# Altium project MK66ofThreeRounds_Project.PrjPcb
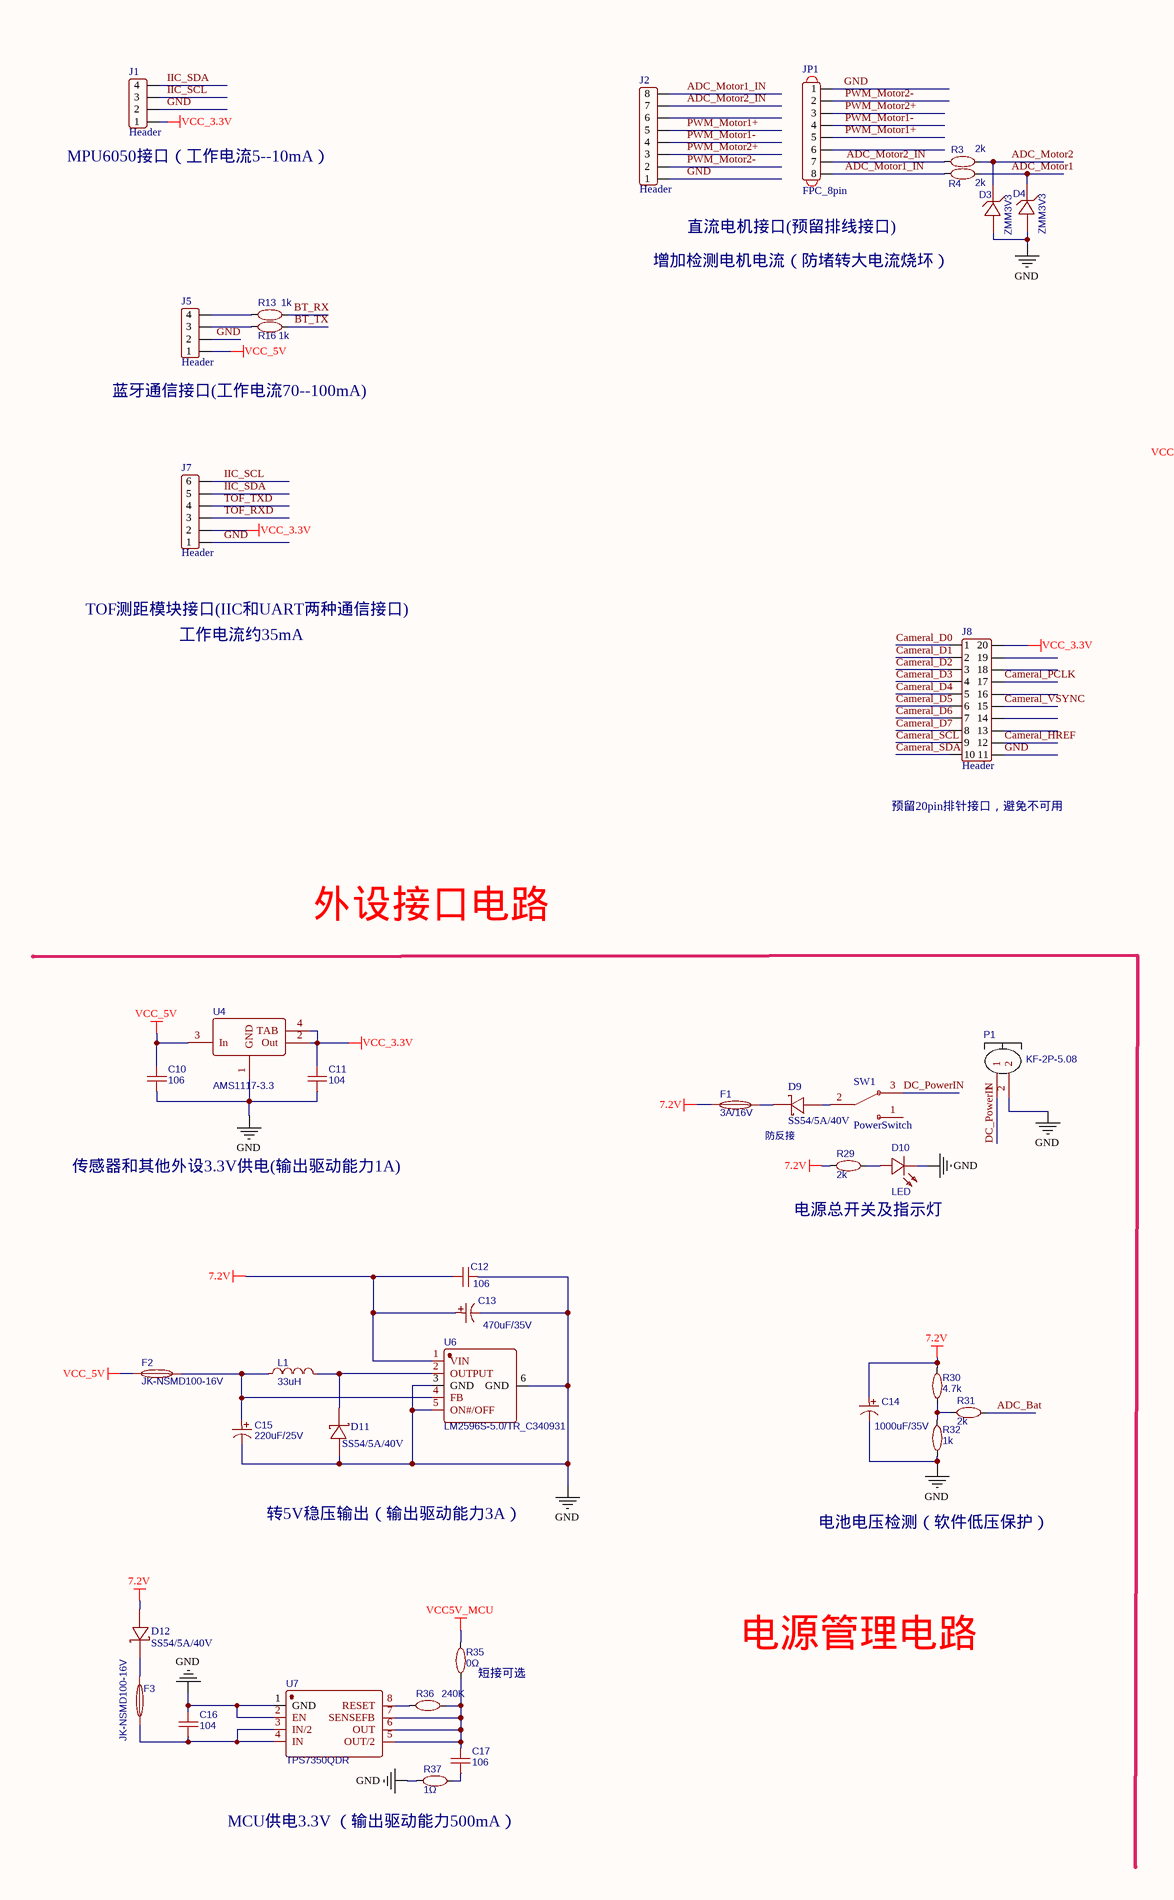
[diagram p0: MK66MCU.SchDoc, left]
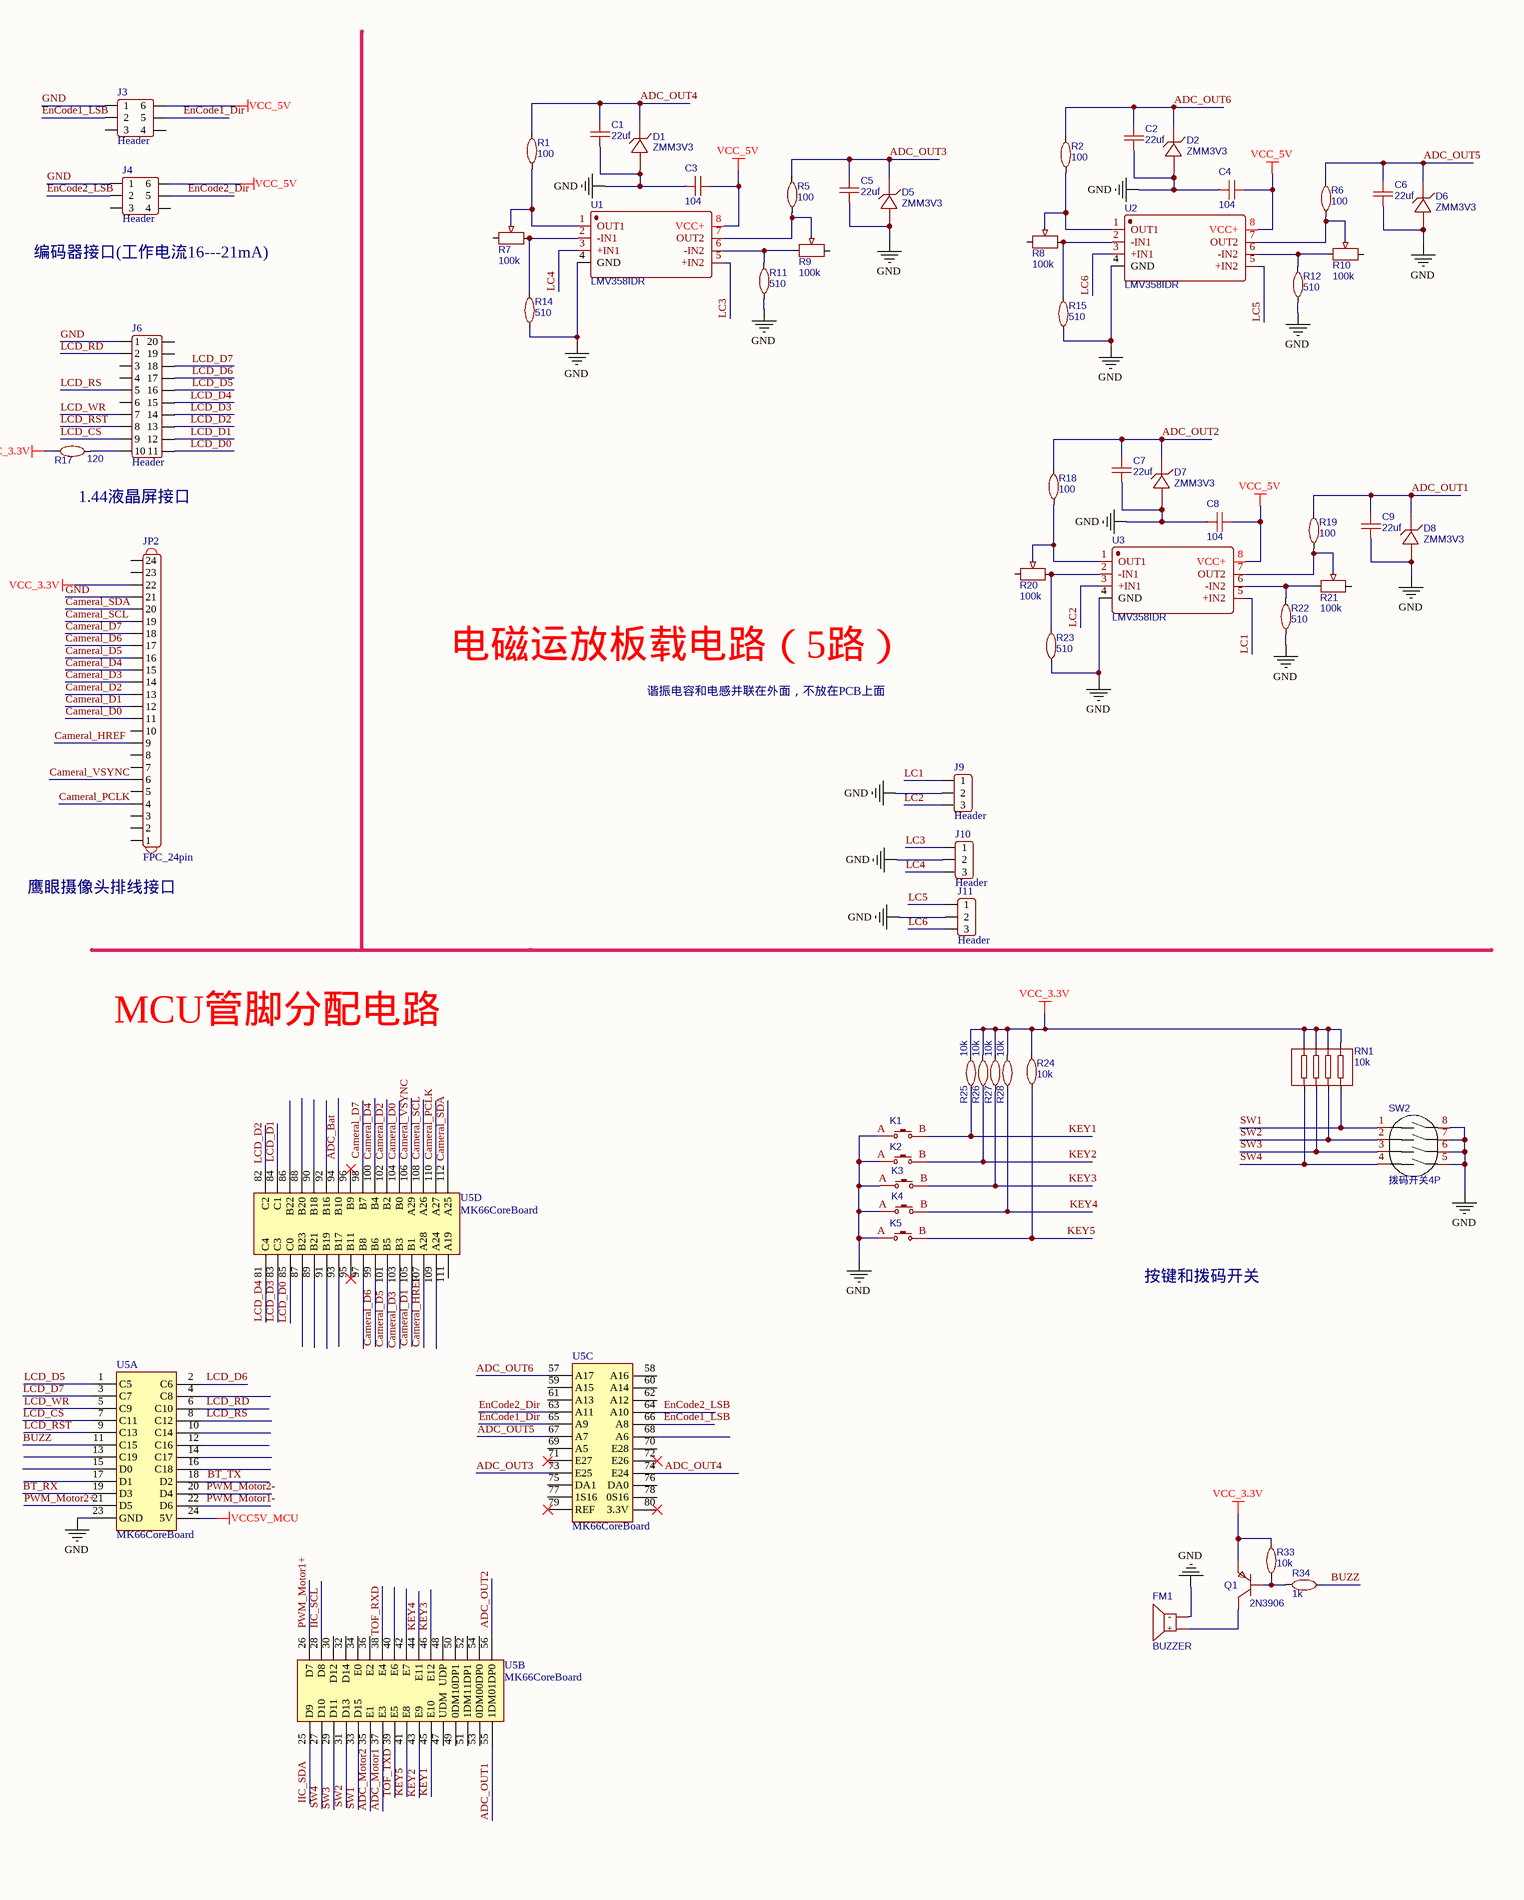
[diagram p1: MK66MCU.SchDoc, right]
1 sheet, 101 parts. Net scope: global (net labels, ports and power ports of the same name join across sheets).
Board file: MK66MUC.PcbDoc

## Sheet MK66MCU.SchDoc
size A2

### Parts
C1  22uf  [CAP_0603]
C2  22uf  [CAP_0603]
C3  104  [CAP_0603]
C4  104  [CAP_0603]
C5  22uf  [CAP_0603]
C6  22uf  [CAP_0603]
C7  22uf  [CAP_0603]
C8  104  [CAP_0603]
C9  22uf  [CAP_0603]
C10  106  [CAP_0603]
C11  104  [CAP_0603]
C12  106  [CAP_0603]
C13  470uF/35V  [CAPE_SMD_F_8.4]
C14  1000uF/35V  [CAPE_SMD_G_10.6]
C15  220uF/25V  [CAPE_SMD_D_6.4]
C16  104  [CAP_0603]
C17  106  [CAP_0603]
D1  ZMM3V3  [LL-34_L3.5-W1.5-RD]
D2  ZMM3V3  [LL-34_L3.5-W1.5-RD]
D3  ZMM3V3  [LL-34_L3.5-W1.5-RD]
D4  ZMM3V3  [LL-34_L3.5-W1.5-RD]
D5  ZMM3V3  [LL-34_L3.5-W1.5-RD]
D6  ZMM3V3  [LL-34_L3.5-W1.5-RD]
D7  ZMM3V3  [LL-34_L3.5-W1.5-RD]
D8  ZMM3V3  [LL-34_L3.5-W1.5-RD]
D9  SS54/5A/40V  [DO214_SMA]
D10  LED  [LED_0603_B]
D11  SS54/5A/40V  [DO214_SMA]
D12  SS54/5A/40V  [DO214_SMA]
F1  3A/16V  [F1206]
F2  JK-NSMD100-16V  [F1206]
F3  JK-NSMD100-16V  [F1206]
FM1  BUZZER  [BUZZ-12*7.5]
J1  Header  [Header 2.54X4]
J2  Header  [Header 2.54X8]
J3  Header  [Header 2.54_2X3]
J4  Header  [Header 2.54_2X3]
J5  Header  [Header F 2.54X4]
J6  Header  [Header F 2.54_2x10]
J7  Header  [Header 2.54X6]
J8  Header  [Header F 2.54_2x10]
J9  Header  [Header 2.54X3]
J10  Header  [Header 2.54X3]
J11  Header  [Header 2.54X3]
JP1  FPC_8pin  [FPC_1.0_8P]
JP2  FPC_24pin  [FPC_0.5_24P]
K1  TS-Button_2P  [SW_SMD_6.1*3.7]  (value not drawn)
K2  TS-Button_2P  [SW_SMD_6.1*3.7]  (value not drawn)
K3  TS-Button_2P  [SW_SMD_6.1*3.7]  (value not drawn)
K4  TS-Button_2P  [SW_SMD_6.1*3.7]  (value not drawn)
K5  TS-Button_2P  [SW_SMD_6.1*3.7]  (value not drawn)
L1  33uH  [IND-SMD_L8.0-W8.0]
P1  KF-2P-5.08  [KF_2P-5.08]
Q1  2N3906  [TO_92A]
R1  100  [RES_0603]
R2  100  [RES_0603]
R3  2k  [RES_0603]
R4  2k  [RES_0603]
R5  100  [RES_0603]
R6  100  [RES_0603]
R7  100k  [RES_POT-3296W]
R8  100k  [RES_POT-3296W]
R9  100k  [RES_POT-3296W]
R10  100k  [RES_POT-3296W]
R11  510  [RES_0603]
R12  510  [RES_0603]
R13  1k  [RES_0603]
R14  510  [RES_0603]
R15  510  [RES_0603]
R16  1k  [RES_0603]
R17  120  [RES_0603]
R18  100  [RES_0603]
R19  100  [RES_0603]
R20  100k  [RES_POT-3296W]
R21  100k  [RES_POT-3296W]
R22  510  [RES_0603]
R23  510  [RES_0603]
R24  10k  [RES_0603]
R25  10k  [RES_0603]
R26  10k  [RES_0603]
R27  10k  [RES_0603]
R28  10k  [RES_0603]
R29  2k  [RES_0603]
R30  4.7k  [RES_0603]
R31  2k  [RES_0603]
R32  1k  [RES_0603]
R33  10k  [RES_0603]
R34  1k  [RES_0603]
R35  0Ω  [RES_0603]
R36  240K  [RES_0603]
R37  1Ω  [RES_0603]
RN1  10k  [RES-ARRAY-SMD_0603-8P-L3.2-W1.6-BL]
SW1  PowerSwitch  [SW-TH_K3-1260D-K1]
SW2  拨码开关4P  [VDG/S-04HG-R]
U1  LMV358IDR  [SOIC-8_150MIL]
U2  LMV358IDR  [SOIC-8_150MIL]
U3  LMV358IDR  [SOIC-8_150MIL]
U4  AMS1117-3.3  [SOT-223_3]
U5  MK66CoreBoard  [MK66_MCU]  (parts A,B,C,D of 4)
U6  LM2596S-5.0/TR_C340931  [TO-263_5]
U7  TPS7350QDR  [SOIC-8_150MIL]

### Nets
7.2V: C12.1 C13.1 C14.1 D12.1(A) F1.2 R29.2 R30.1 U6.1(VIN)
GND: C1.2 C2.2 C3.2 C4.2 C5.2 C6.2 C7.2 C8.2 C9.2 C10.2 C11.2 C12.2 C13.2 C14.2 C15.2 C16.1 D1.2(A) D2.2(A) D3.2(A) D4.2(A) D5.2(A) D6.2(A) D7.2(A) D8.2(A) D10.C D11.1(A) FM1.2(－) J1.2 J2.1 J3.1 J4.1 J5.2 J6.1 J7.1 J8.11 J9.2 J10.2 J11.2 JP1.1 JP2.21 K1.A K2.A K3.A K4.A K5.A P1.2 R11.1 R12.1 R14.2 R15.2 R22.1 R23.2 R32.2 R37.1 SW2.5 SW2.6 SW2.7 SW2.8 U1.4(GND) U2.4(GND) U3.4(GND) U4.1(GND) U5.23(GND) U6.3(GND) U6.5(ON#/OFF) U6.6(GND) U7.1(GND) U7.2(EN)
VCC5V_MCU: R35.2 U5.24(5V)
VCC_3.3V: C11.1 J1.1 J7.2 J8.20 JP2.22 Q1.1(E) R17.2 R24.2 R25.2 R26.2 R27.2 R28.2 R33.1 RN1.5 RN1.6 RN1.7 RN1.8 U4.2(Out) U4.4(TAB)
VCC_5V: C3.1 C4.1 C8.1 C10.1 F2.2 J3.6 J4.6 J5.1 U1.8(VCC+) U2.8(VCC+) U3.8(VCC+) U4.3(In)
ADC_Bat: R31.2 U5.94(B10)
ADC_Motor1: D4.1(C) R4.1 U5.37(E3)
ADC_Motor1_IN: J2.8 JP1.8 R4.2
ADC_Motor2: D3.1(C) R3.1 U5.35(E1)
ADC_Motor2_IN: J2.7 JP1.7 R3.2
ADC_OUT1: C9.1 D8.1(C) R19.1 U5.55(1DM0)
ADC_OUT2: C7.1 D7.1(C) R18.1 U5.56(1DP0)
ADC_OUT3: C5.1 D5.1(C) R5.1 U5.73(E25)
ADC_OUT4: C1.1 D1.1(C) R1.1 U5.74(E24)
ADC_OUT5: C6.1 D6.1(C) R6.1 U5.67(A7)
ADC_OUT6: C2.1 D2.1(C) R2.1 U5.57(A17)
BT_RX: R13.1 U5.19(D3)
BT_TX: R16.1 U5.18(D2)
BUZZ: R34.1 U5.11(C15)
Cameral_D0: J8.1 JP2.11 U5.104(B0)
Cameral_D1: J8.2 JP2.12 U5.105(B1)
Cameral_D2: J8.3 JP2.13 U5.102(B2)
Cameral_D3: J8.4 JP2.14 U5.103(B3)
Cameral_D4: J8.5 JP2.15 U5.100(B4)
Cameral_D5: J8.6 JP2.16 U5.101(B5)
Cameral_D6: J8.7 JP2.17 U5.99(B6)
Cameral_D7: J8.8 JP2.18 U5.98(B7)
Cameral_HREF: J8.12 JP2.9 U5.107(A28)
Cameral_PCLK: J8.17 JP2.4 U5.110(A27)
Cameral_SCL: J8.9 JP2.19 U5.108(A26)
Cameral_SDA: J8.10 JP2.20 U5.112(A25)
Cameral_VSYNC: J8.15 JP2.6 U5.106(A29)
DC_PowerIN: P1.1 SW1.3(NC)
EnCode1_Dir: J3.5 U5.65(A9)
EnCode1_LSB: J3.2 U5.66(A8)
EnCode2_Dir: J4.5 U5.63(A11)
EnCode2_LSB: J4.2 U5.64(A10)
IIC_SCL: J1.3 J7.6 U5.28(D8)
IIC_SDA: J1.4 J7.5 U5.25(D9)
KEY1: K1.B R25.1 U5.45(E10)
KEY2: K2.B R26.1 U5.43(E9)
KEY3: K3.B R27.1 U5.46(E12)
KEY4: K4.B R28.1 U5.44(E11)
KEY5: K5.B R24.1 U5.41(E8)
LC1: J9.1 U3.5(+IN2)
LC2: J9.3 U3.3(+IN1)
LC3: J10.1 U1.5(+IN2)
LC4: J10.3 U1.3(+IN1)
LC5: J11.1 U2.5(+IN2)
LC6: J11.3 U2.3(+IN1)
LCD_CS: J6.9 U5.7(C11)
LCD_D0: J6.11 U5.85(C0)
LCD_D1: J6.12 U5.84(C1)
LCD_D2: J6.13 U5.82(C2)
LCD_D3: J6.14 U5.83(C3)
LCD_D4: J6.15 U5.81(C4)
LCD_D5: J6.16 U5.1(C5)
LCD_D6: J6.17 U5.2(C6)
LCD_D7: J6.18 U5.3(C7)
LCD_RD: J6.2 U5.6(C10)
LCD_RS: J6.5 U5.8(C12)
LCD_RST: J6.8 U5.9(C13)
LCD_WR: J6.7 U5.5(C9)
PWM_Motor1+: J2.5 JP1.5 U5.26(D7)
PWM_Motor1-: J2.4 JP1.4 U5.22(D6)
PWM_Motor2+: J2.3 JP1.3 U5.21(D5)
PWM_Motor2-: J2.2 JP1.2 U5.20(D4)
SW1: RN1.4 SW2.1 U5.33(D15)
SW2: RN1.3 SW2.2 U5.31(D13)
SW3: RN1.2 SW2.3 U5.29(D11)
SW4: RN1.1 SW2.4 U5.27(D10)
TOF_RXD: J7.3 U5.38(E4)
TOF_TXD: J7.4 U5.39(E5)
NetC15_1: C15.1 F2.1 L1.1 U6.4(FB)
NetC16_2: C16.2 F3.1 U7.3(IN/2) U7.4(IN)
NetC17_1: C17.1 R35.1 R36.2 U7.5(OUT/2) U7.6(OUT) U7.7(SENSEFB)
NetC17_2: C17.2 R37.2
NetD9_1: D9.1(A) SW1.2(C)
NetD9_2: D9.2(C) F1.1
NetD10_A: D10.A R29.1
NetD11_2: D11.2(C) L1.2 U6.2(OUTPUT)
NetD12_2: D12.2(C) F3.2
NetFM1_1: FM1.1(+) Q1.3(C)
NetJ5_3: J5.3 R16.2
NetJ5_4: J5.4 R13.2
NetJ6_10: J6.10 R17.1
NetQ1_2: Q1.2(B) R33.2 R34.2
NetR1_2: R1.2 R7.2 U1.1(OUT1)
NetR2_2: R2.2 R8.2 U2.1(OUT1)
NetR5_2: R5.2 R9.2 U1.7(OUT2)
NetR6_2: R6.2 R10.2 U2.7(OUT2)
NetR7_3: R7.3 R14.1 U1.2(-IN1)
NetR8_3: R8.3 R15.1 U2.2(-IN1)
NetR9_1: R9.1 R11.2 U1.6(-IN2)
NetR10_1: R10.1 R12.2 U2.6(-IN2)
NetR18_2: R18.2 R20.2 U3.1(OUT1)
NetR19_2: R19.2 R21.2 U3.7(OUT2)
NetR20_3: R20.3 R23.1 U3.2(-IN1)
NetR21_1: R21.1 R22.2 U3.6(-IN2)
NetR30_2: R30.2 R31.1 R32.1
NetR36_1: R36.1 U7.8(RESET)

Not connected (* = marked no-connect by the designer): J2 6; J3 3 4; J4 3 4; J6 3 4 6 19 20; J8 13 14 16 18 19; JP1 6; JP2 1 2 3 5 7 8 10 23 24; R7 1; R8 1; R9 3; R10 3; R20 1; R21 3; SW1 1(ON); U5 4(C8) 10(C14) 12(C16) 13(C19) 14(C17) 15(D0) 16(C18) 17(D1) 30(D12) 32(D14) 34(E0) 36(E2) 40(E6) 42(E7) 47(UDM) 48(UDP) 49(0DM1) 50(0DP1) 51(1DM1) 52(1DP1) 53(0DM0) 54(0DP0) 58(A16) 59(A15) 60(A14) 61(A13) 62(A12) 68(A6) 69(A5) 70(E28) 71(E27)* 72(E26)* 75(DA1) 76(DA0) 77(1S16) 78(0S16) 79(REF)* 80(3.3V)* 86(B22) 87(B23) 88(B20) 89(B21) 90(B18) 91(B19) 92(B16) 93(B17) 95(B11)* 96(B9)* 97(B8) 109(A24) 111(A19)

### Notes on the sheet
- (near J1) MPU6050接口（工作电流5--10mA）
- 增加检测电机电流（防堵转大电流烧坏）
- 直流电机接口(预留排线接口)
- (near J4) 编码器接口(工作电流16---21mA)
- (near J5) 蓝牙通信接口(工作电流70--100mA)
- 1.44液晶屏接口
- TOF测距模块接口(IIC和UART两种通信接口)
- 工作电流约35mA
- 电磁运放板载电路（5路）
- 谐振电容和电感并联在外面，不放在PCB上面
- (near J8) 预留20pin排针接口，避免不可用
- 鹰眼摄像头排线接口
- 外设接口电路
- MCU管脚分配电路
- 防反接
- 传感器和其他外设3.3V供电(输出驱动能力1A)
- 电源总开关及指示灯
- 按键和拨码开关
- 转5V稳压输出（输出驱动能力3A）
- 电池电压检测（软件低压保护）
- (near R35) 短接可选
- 电源管理电路
- (near R37) MCU供电3.3V （输出驱动能力500mA）

### Library data of the parts
C1-C12 C16 C17 = CAP_0603: BOM_Manufacturer: Samsung Electro-Mechanics; BOM_Manufacturer Part: CL10B104KB8WPNC; nameAlias: Capacitance; Contributor: LCSC; BOM_Supplier: LCSC; BOM_Supplier Part: C307348; spicePre: C; spiceSymbolName: CL10B104KB8WPNC
C13-C15 = CAP_E_SMD: 贴片电解电容; BOM_Manufacturer: ROQANG; BOM_Manufacturer Part: RVT1C221M0607; nameAlias: Capacitance; BOM_Supplier: LCSC; BOM_Supplier Part: C72496; spicePre: C; spiceSymbolName: RVT1C221M0607
D1-D8 = ZMM3V3: BOM_Manufacturer: SEMTECH; SMT Type: Basic; BOM_Supplier: LCSC; BOM_Manufacturer Part: ZMM3V3; BOM_LCSC Assembly: Yes; image: //image.lceda.cn/szlcsc/C8056.jpg; BOM_Supplier Part: C8056; spicePre: D; spiceSymbolName: ZMM3V3
D9 D11 D12 = SS54
D10 = LED_0603: 发光LED; BOM_Manufacturer: ARKLED; BOM_Manufacturer Part: D-G080508G1; Contributor: LCSC; BOM_Supplier: LCSC; BOM_Supplier Part: C107402; spicePre: L; spiceSymbolName: D-G080508G1
F1-F3 = JK-NSMD100-16V: BOM_Manufacturer: Jinrui Electronic Materials Co.; Contributor: LCSC; BOM_Supplier: LCSC; BOM_Supplier Part: C369161; BOM_Manufacturer Part: JK-NSMD100-16V; spicePre: F; spiceSymbolName: JK-NSMD100-16V
FM1 = BUZZER: 蜂鸣器; BOM_Manufacturer: HNDZ; BOM_Manufacturer Part: TMB12A12; BOM_Supplier: LCSC; BOM_Supplier Part: C96079; spicePre: B; spiceSymbolName: TMB12A12
J1 J5 = Header 2.54_4
J2 = Header 2.54_8
J3 J4 = Header 2.54_2X3
J6 J8 = Header 2.54_2X10
J7 = Header 2.54_6
J9-J11 = Header 2.54_3
K1-K5 = TS-Button_2P: 贴片按键 3*6*2.5; BOM_Manufacturer: XUNPU; BOM_Manufacturer Part: TS-1007S-26; Contributor: LCSC; BOM_Supplier: LCSC; BOM_Supplier Part: C455236; spicePre: S; spiceSymbolName: TS-1007S-26
L1 = Inductor: BOM_Manufacturer: TDK; BOM_Manufacturer Part: NLV25T-330J-EF; nameAlias: Inductance; Contributor: LCSC; BOM_Supplier: LCSC; BOM_Supplier Part: C295130; spicePre: L; spiceSymbolName: NLV25T-330J-EF
P1 = KF-2P-5.08: 端子2P; BOM_Manufacturer: ReliaPro; BOM_Manufacturer Part: WJ500H-5.08-2P; BOM_Supplier: LCSC; image: //image.lceda.cn/szlcsc/C8478.jpg; BOM_Supplier Part: C8478; spicePre: P; spiceSymbolName: WJ500H-5.08-2P
Q1 = 2N3906: 三极管PNP; BOM_Manufacturer: BLUE ROCKET; Contributor: LCSC; BOM_Supplier: LCSC; BOM_Supplier Part: C305396; BOM_Manufacturer Part: 2N3906; spicePre: Q; spiceSymbolName: 2N3906_C305396
R1-R6 R11-R19 R22-R37 = RES_0603: BOM_Manufacturer: YAGEO; BOM_Manufacturer Part: RC0402JR-07100KL; nameAlias: Resistance (Ohms); BOM_Supplier: LCSC; BOM_Supplier Part: C106234; spicePre: R; spiceSymbolName: RC0402JR-07100KL
R7-R10 R20 R21 = RES_POT-3296W: 可调电阻3296W; BOM_Manufacturer: Chengdu Guosheng Tech; BOM_Manufacturer Part: 3296W-1-104; nameAlias: Resistance (Ohms); Contributor: LCSC; BOM_Supplier: LCSC; BOM_Supplier Part: C118963; Resistance(Ohms): 100K; spicePre: R; spiceSymbolName: 3296W-1-104
RN1 = RESW4: BOM_Manufacturer: YAGEO; BOM_Manufacturer Part: YC164-JR-0710KL; nameAlias: Resistance (Ohms); BOM_Supplier: LCSC; BOM_Supplier Part: C107374; spicePre: R; spiceSymbolName: YC164-JR-0710KL
SW2 = 拨码开关4P: DIP_4PX2*2.54; BOM_Manufacturer: ReliaPro; BOM_Supplier: LCSC; BOM_Manufacturer Part: VDG/S-04HG-R; image: //image.lceda.cn/szlcsc/C15781.jpg; BOM_Supplier Part: C15781; spicePre: D; spiceSymbolName: VDG/S-04HG-R
U1-U3 = LMV358IDR: BOM_Manufacturer: TI; SMT Type: Extend; BOM_Supplier: LCSC; BOM_Manufacturer Part: LMV358IDR; BOM_Supplier Part: C63813; BOM_LCSC Assembly: Yes; spicePre: U; spiceSymbolName: LMV358IDR
U4 = AMS1117-3.3: BOM_Manufacturer: SK; Contributor: LCSC; SMT Type: Extend; BOM_Supplier: LCSC; BOM_Supplier Part: C165482; BOM_Manufacturer Part: AMS1117-3.3; BOM_LCSC Assembly: Yes; spicePre: U; spiceSymbolName: AMS1117-3.3_C165482
U6 = LM2596S-5.0/TR_C340931: BOM_Manufacturer: Huaguan Semicon; Contributor: LCSC; BOM_Supplier: LCSC; BOM_Supplier Part: C340931; BOM_Manufacturer Part: LM2596S-5.0/TR; spicePre: U; spiceSymbolName: LM2596S-5.0/TR_C340931
U7 = TPS7350QDR: BOM_Manufacturer: TI; BOM_Manufacturer Part: TPS7333QDR; SMT Type: Extend; spicePre: X; BOM_Supplier: LCSC; image: //image.lceda.cn/szlcsc/C23791.jpg; BOM_Supplier Part: C23791; BOM_LCSC Assembly: Yes; spiceSymbolName: TPS7333QDR